# EAGLE design braeburn (EAGLE 6.1)
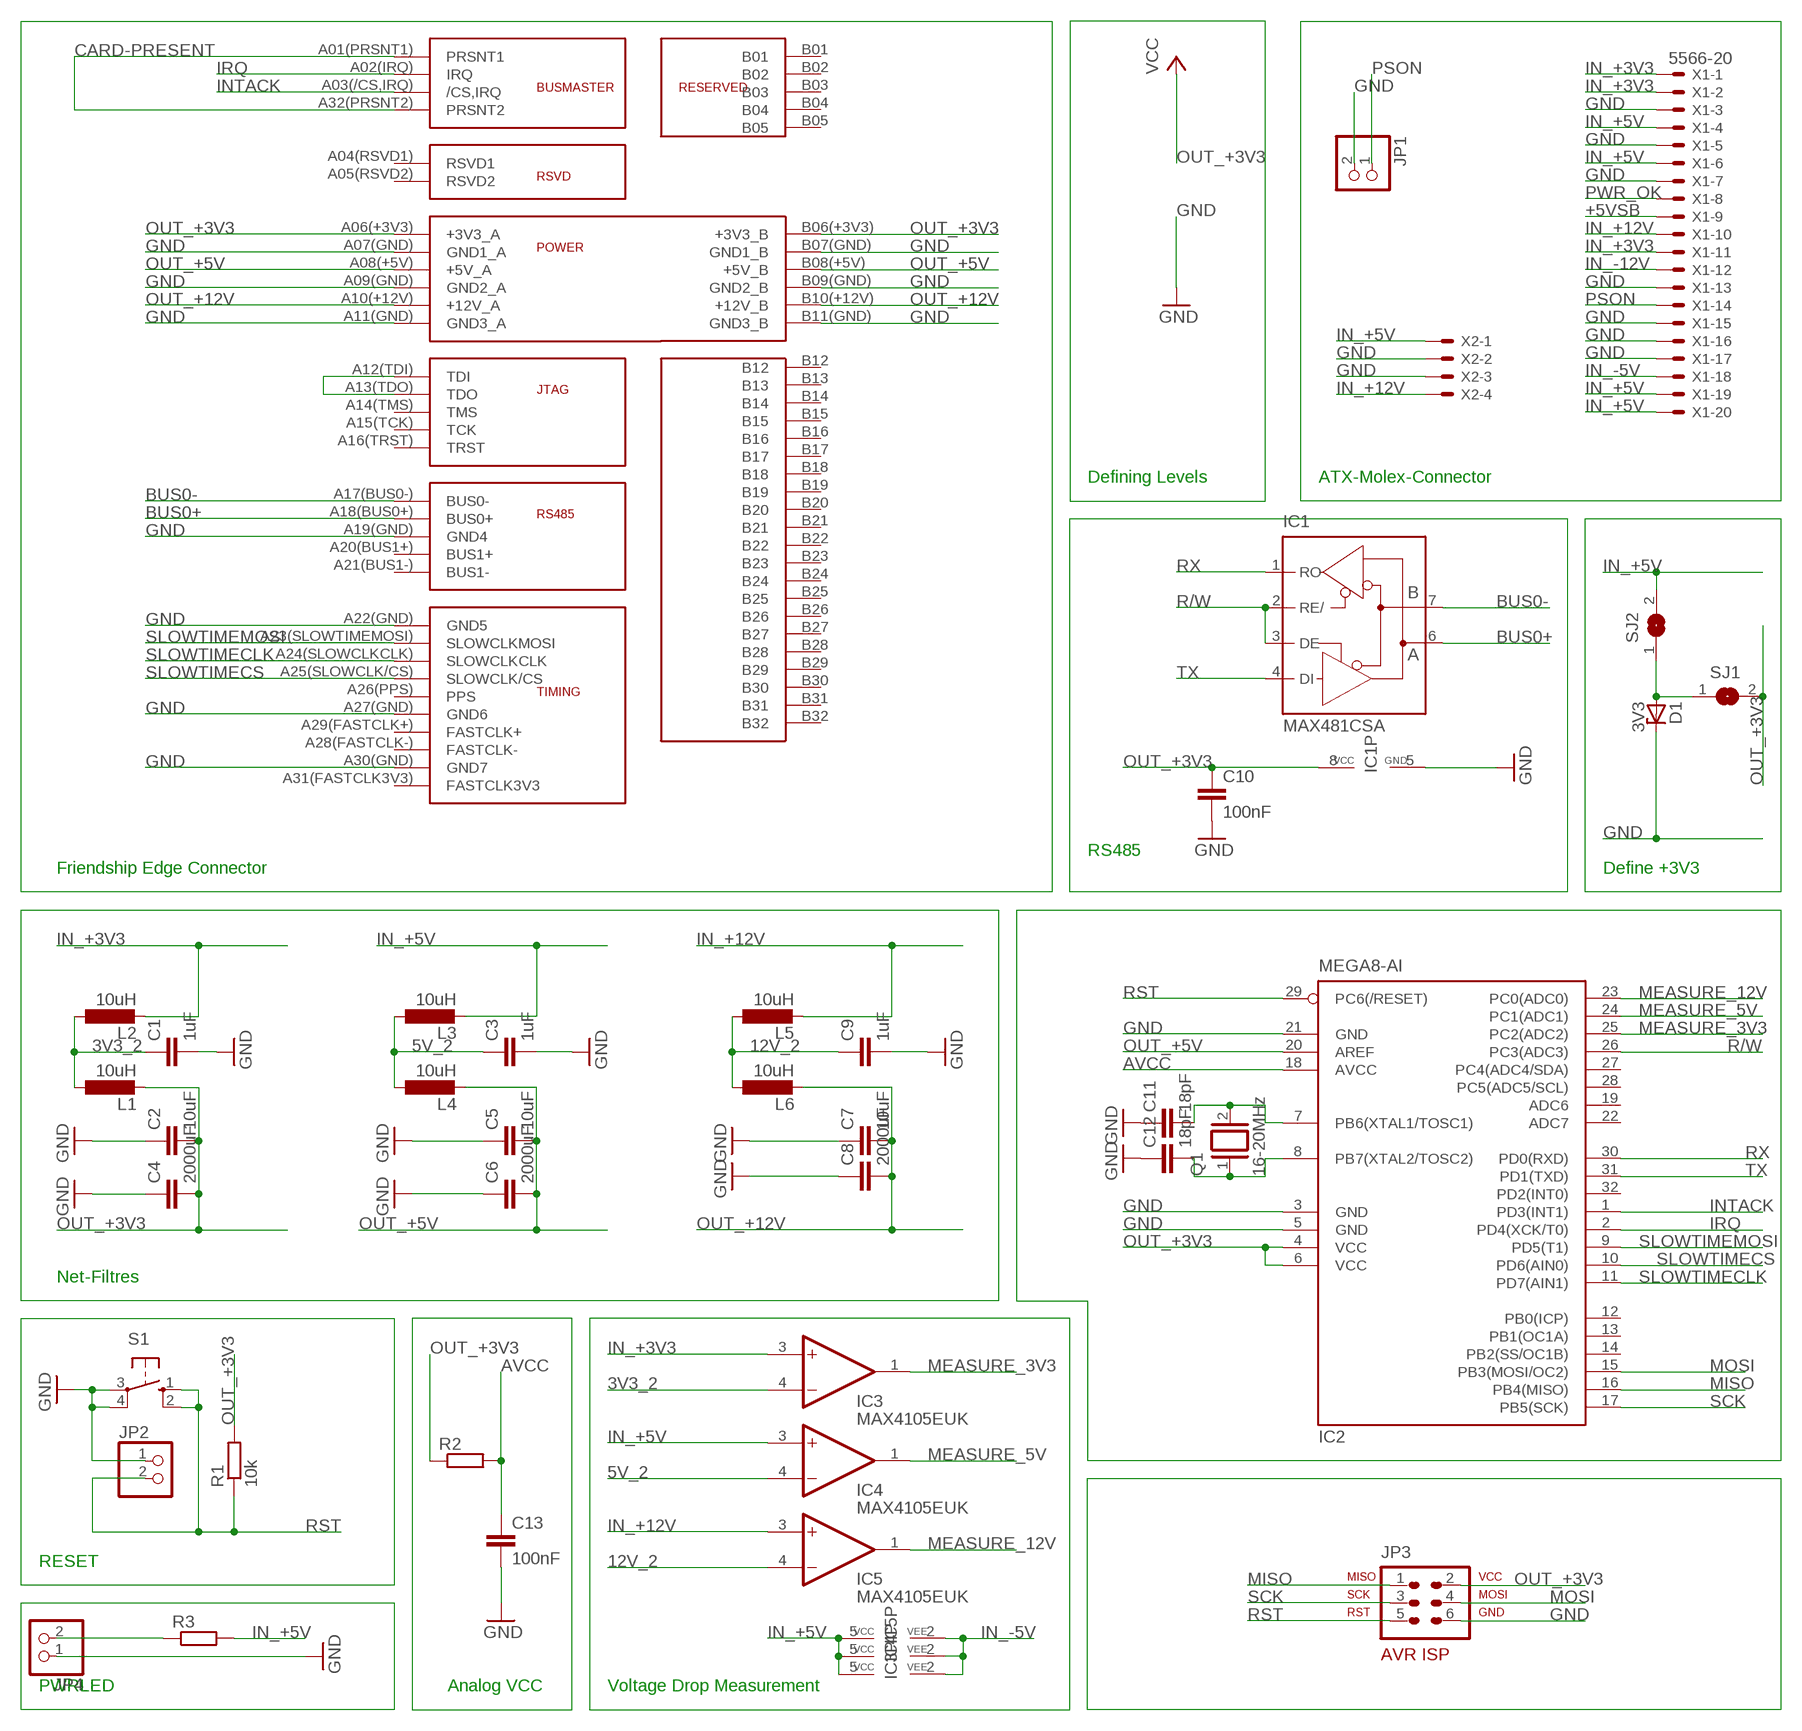
[diagram p0: schematic, sheet 1]

## Parts
C1  1uF  C-EUC0805  [C0805]
C2  10uF  C-EUC0603  [C0603]
C3  1uF  C-EUC0805  [C0805]
C4  2000uF  C-EU025-060X050  [C025-060X050]
C5  10uF  C-EUC0603  [C0603]
C6  2000uF  C-EU025-060X050  [C025-060X050]
C7  10uF  C-EUC0603  [C0603]
C8  2000uF  C-EU025-060X050  [C025-060X050]
C9  1uF  C-EUC0805  [C0805]
C10  100nF  C-EUC0603  [C0603]
C11  18pF  C-EUC0603  [C0603]
C12  18pF  C-EUC0603  [C0603]
C13  100nF  C-EUC0603  [C0603]
D1  3V3  1N4728  [DO41Z10]
IC1  MAX481CSA  [SO08]
IC2  MEGA8-AI  [TQFP32-08]
IC3  MAX4105EUK  [SOT23-5L]
IC4  MAX4105EUK  [SOT23-5L]
IC5  MAX4105EUK  [SOT23-5L]
JP1  PINHD-1X2  [1X02]
JP2  PINHD-1X2  [1X02]
JP3  AVR-ISP-6VERT  [AVR-ISP-6]
JP4  PINHD-1X2  [1X02]
L1  10uH  L-EU0207/5V  [0207/5V]
L2  10uH  L-EU0207/5V  [0207/5V]
L3  10uH  L-EU0207/5V  [0207/5V]
L4  10uH  L-EU0207/5V  [0207/5V]
L5  10uH  L-EU0207/5V  [0207/5V]
L6  10uH  L-EU0207/5V  [0207/5V]
Q1  16-20MHz  XTAL/S  [QS]
R1  10k  R-EU_R0603  [R0603]
R2  R-EU_R0603  [R0603]
R3  R-EU_R0603  [R0603]
S1  10-XX  [B3F-10XX]
SJ1  SJW  [SJW]
SJ2  SJW  [SJW]
U$1  FRIENDSHIPCONNECTOR  [FRIENDSHIP_EDGE_CONNECTOR]
X1  5566-20  [5566-20]
X2  KK-156-4  [KK-156-4]

## Nets
3V3_2: C1.1 IC3.4(-IN) L1.1 L2.1
5V_2: C3.1 IC4.4(-IN) L3.1 L4.1
12V_2: C9.1 IC5.4(-IN) L5.1 L6.1
+5VSB: X1.9
AVCC: C13.1 IC2.18(AVCC) R2.2
BUS0+: IC1.6(A) U$1.A18(BUS0+)(BUS0+)
BUS0-: IC1.7(B) U$1.A17(BUS0-)(BUS0-)
CARD-PRESENT: U$1.A01(PRSNT1)(PRSNT1) U$1.A32(PRSNT2)(PRSNT2)
GND: C1.2 C2.1 C3.2 C4.1 C5.1 C6.1 C7.1 C8.1 C9.2 C10.2 C11.1 C12.1 C13.2 D1.C IC1.5(GND) IC2.3(GND) IC2.5(GND) IC2.21(GND) JP1.2 JP2.1 JP3.6 JP4.1 S1.3(P) S1.4(P1) U$1.A07(GND)(GND1_A) U$1.A09(GND)(GND2_A) U$1.A11(GND)(GND3_A) U$1.A19(GND)(GND4) U$1.A22(GND)(GND5) U$1.A27(GND)(GND6) U$1.A30(GND)(GND7) U$1.B07(GND)(GND1_B) U$1.B09(GND)(GND2_B) U$1.B11(GND)(GND3_B) X1.3 X1.5 X1.7 X1.13 X1.15 X1.16 X1.17 X2.2 X2.3
IN_+3V3: IC3.3(+IN) L2.2 X1.1 X1.2 X1.11
IN_+5V: IC3.5(VCC) IC4.3(+IN) IC4.5(VCC) IC5.5(VCC) L3.2 R3.2 SJ2.2 X1.4 X1.6 X1.19 X1.20 X2.1
IN_+12V: IC5.3(+IN) L5.2 X1.10 X2.4
IN_-5V: IC3.2(VEE) IC4.2(VEE) IC5.2(VEE) X1.18
IN_-12V: X1.12
INTACK: IC2.1(PD3(INT1)) U$1.A03(/CS,IRQ)(/CS,IRQ)
IRQ: IC2.2(PD4(XCK/T0)) U$1.A02(IRQ)(IRQ)
MEASURE_3V3: IC2.25(PC2(ADC2)) IC3.1(OUT)
MEASURE_5V: IC2.24(PC1(ADC1)) IC4.1(OUT)
MEASURE_12V: IC2.23(PC0(ADC0)) IC5.1(OUT)
MISO: IC2.16(PB4(MISO)) JP3.1
MOSI: IC2.15(PB3(MOSI/OC2)) JP3.4
N$4: U$1.A12(TDI)(TDI) U$1.A13(TDO)(TDO)
N$8: JP4.2 R3.1
N$12: C11.2 IC2.7(PB6(XTAL1/TOSC1)) Q1.2
N$13: C12.2 IC2.8(PB7(XTAL2/TOSC2)) Q1.1
N$15: D1.A SJ1.1 SJ2.1
OUT_+3V3: C2.2 C4.2 C10.1 IC1.8(VCC) IC2.4(VCC) IC2.6(VCC) JP3.2 L1.2 R1.2 R2.1 SJ1.2 U$1.A06(+3V3)(+3V3_A) U$1.B06(+3V3)(+3V3_B) ; supply symbol labelled VCC
OUT_+5V: C5.2 C6.2 IC2.20(AREF) L4.2 U$1.A08(+5V)(+5V_A) U$1.B08(+5V)(+5V_B)
OUT_+12V: C7.2 C8.2 L6.2 U$1.A10(+12V)(+12V_A) U$1.B10(+12V)(+12V_B)
PSON: JP1.1 X1.14
PWR_OK: X1.8
R/W: IC1.2(RE/) IC1.3(DE) IC2.26(PC3(ADC3))
RST: IC2.29(PC6(/RESET)) JP2.2 JP3.5 R1.1 S1.1(S) S1.2(S1)
RX: IC1.1(RO) IC2.30(PD0(RXD))
SCK: IC2.17(PB5(SCK)) JP3.3
SLOWTIMECLK: IC2.11(PD7(AIN1)) U$1.A24(SLOWCLKCLK)(SLOWCLKCLK)
SLOWTIMECS: IC2.10(PD6(AIN0)) U$1.A25(SLOWCLK/CS)(SLOWCLK/CS)
SLOWTIMEMOSI: IC2.9(PD5(T1)) U$1.A23(SLOWTIMEMOSI)(SLOWCLKMOSI)
TX: IC1.4(DI) IC2.31(PD1(TXD))
Unconnected: IC2.12(PB0(ICP)) IC2.13(PB1(OC1A)) IC2.14(PB2(SS/OC1B)) IC2.19(ADC6) IC2.22(ADC7) IC2.27(PC4(ADC4/SDA)) IC2.28(PC5(ADC5/SCL)) IC2.32(PD2(INT0)) U$1.A04(RSVD1)(RSVD1) U$1.A05(RSVD2)(RSVD2) U$1.A14(TMS)(TMS) U$1.A15(TCK)(TCK) U$1.A16(TRST)(TRST) U$1.A20(BUS1+)(BUS1+) U$1.A21(BUS1-)(BUS1-) U$1.A26(PPS)(PPS) U$1.A28(FASTCLK-)(FASTCLK-) U$1.A29(FASTCLK+)(FASTCLK+) U$1.A31(FASTCLK3V3)(FASTCLK3V3) U$1.B01 U$1.B02 U$1.B03 U$1.B04 U$1.B05 U$1.B12 U$1.B13 U$1.B14 U$1.B15 U$1.B16 U$1.B17 U$1.B18 U$1.B19 U$1.B20 U$1.B21 U$1.B22 U$1.B23 U$1.B24 U$1.B25 U$1.B26 U$1.B27 U$1.B28 U$1.B29 U$1.B30 U$1.B31 U$1.B32

## Notes on the sheet
- Defining Levels | ATX-Molex-Connector
- RS485
- Friendship Edge Connector | Define +3V3
- Net-Filtres
- RESET
- PWRLED | Analog VCC | Voltage Drop Measurement

## Library data of the parts
C1-C13 = rcl:C-EU: CAPACITOR, European symbol
D1 = diode:1N4728: Z DIODE 3.3 V, 1W, 5 percent
IC1 = maxim:MAX481CSA: RS485 TRANSEIVER; MF: MAXIM; MPN: MAX481CSA; OC_FARNELL: unknown; OC_NEWARK: 90C3817
IC2 = atmel:MEGA8: MICROCONTROLLER 8 Kbytes FLASH, 1 kbytes SRAM, 512 bytes EEPROM, USART, 6-channel 10 bit ADC, 2-channel 8 bit ADC Pin compatible with Atmega48, ATMega88, ATMega168 Source: avr.lbr; MPN: ATMEGA8-16AU; OC_FARNELL: 9171371; OC_NEWARK: 73M8863
IC3-IC5 = maxim:MAX4105EUK: OP AMP; MPN: MAX4105EUK+T; OC_FARNELL: unknown; OC_NEWARK: 67K5152
JP1 JP2 JP4 = pinhead:PINHD-1X2: PIN HEADER
JP3 = avr-7:AVR-ISP-6: AVR ISP-6 Serial Programming Header
L1-L6 = rcl:L-EU: INDUCTOR, European symbol
Q1 = special:XTAL/S: CRYSTAL
R1-R3 = rcl:R-EU_: RESISTOR, European symbol
S1 = switch-omron:10-XX: OMRON SWITCH; MPN: B3F-1000; OC_FARNELL: 176432; OC_NEWARK: 36M3542
SJ1 SJ2 = jumper:SJ: SMD solder JUMPER
U$1 = hgg:FRIENDSHIP
X1 = con-molex:5566-20: Mini FIT connector 20 pol ATX PC-Motherboard Power connector Source: http://www.molex.com; OC_FARNELL: unknown; OC_NEWARK: unknown
X2 = con-molex:KK-156-4: KK 156 HEADER Source: http://www.molex.com/pdm_docs/sd/026604100_sd.pdf; OC_FARNELL: unknown; OC_NEWARK: unknown

## Board
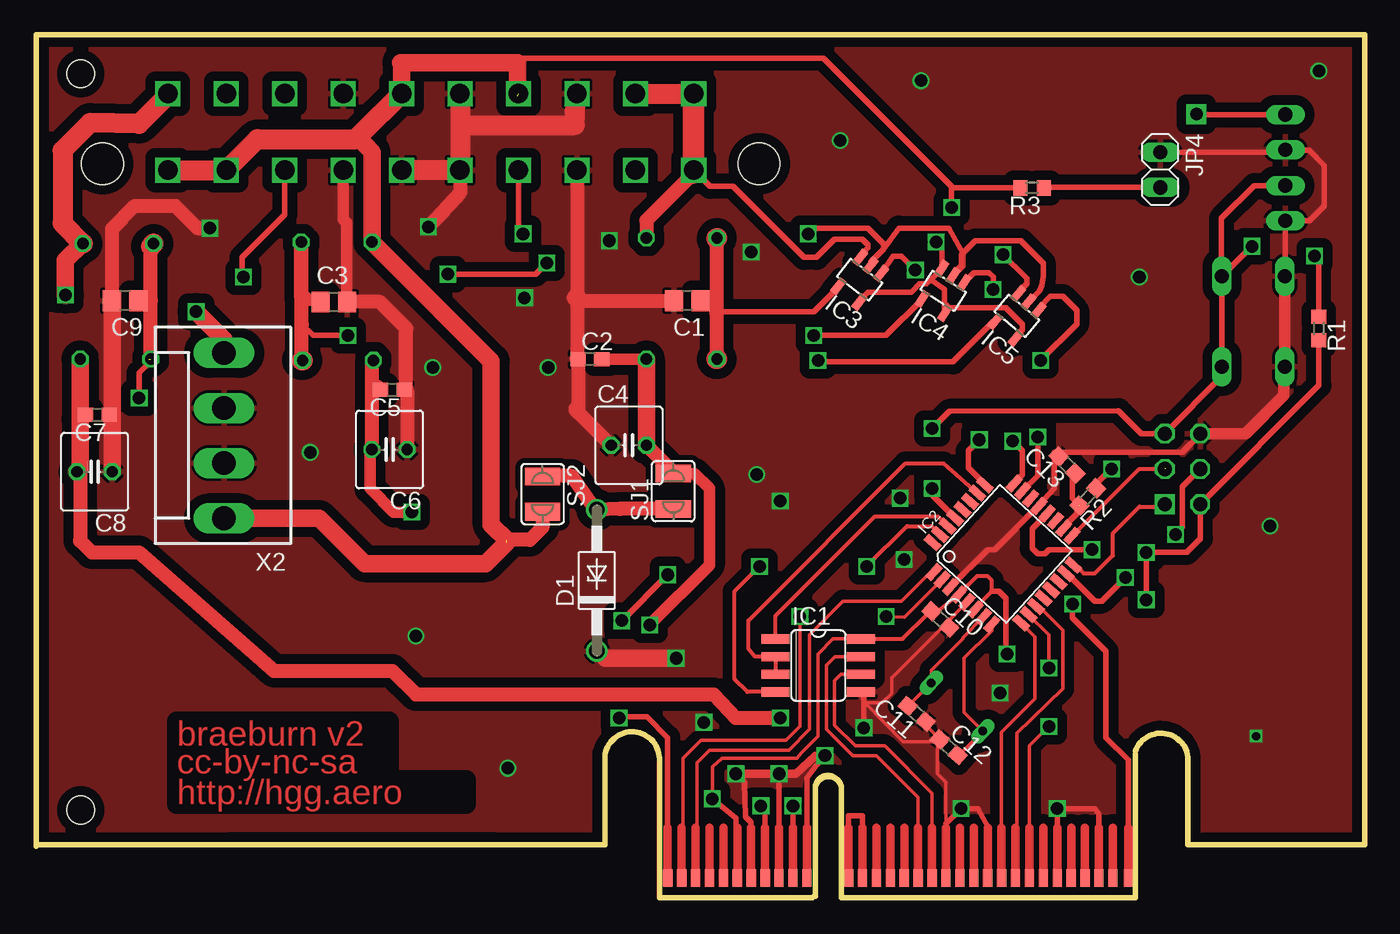
[diagram p1: board, top side]
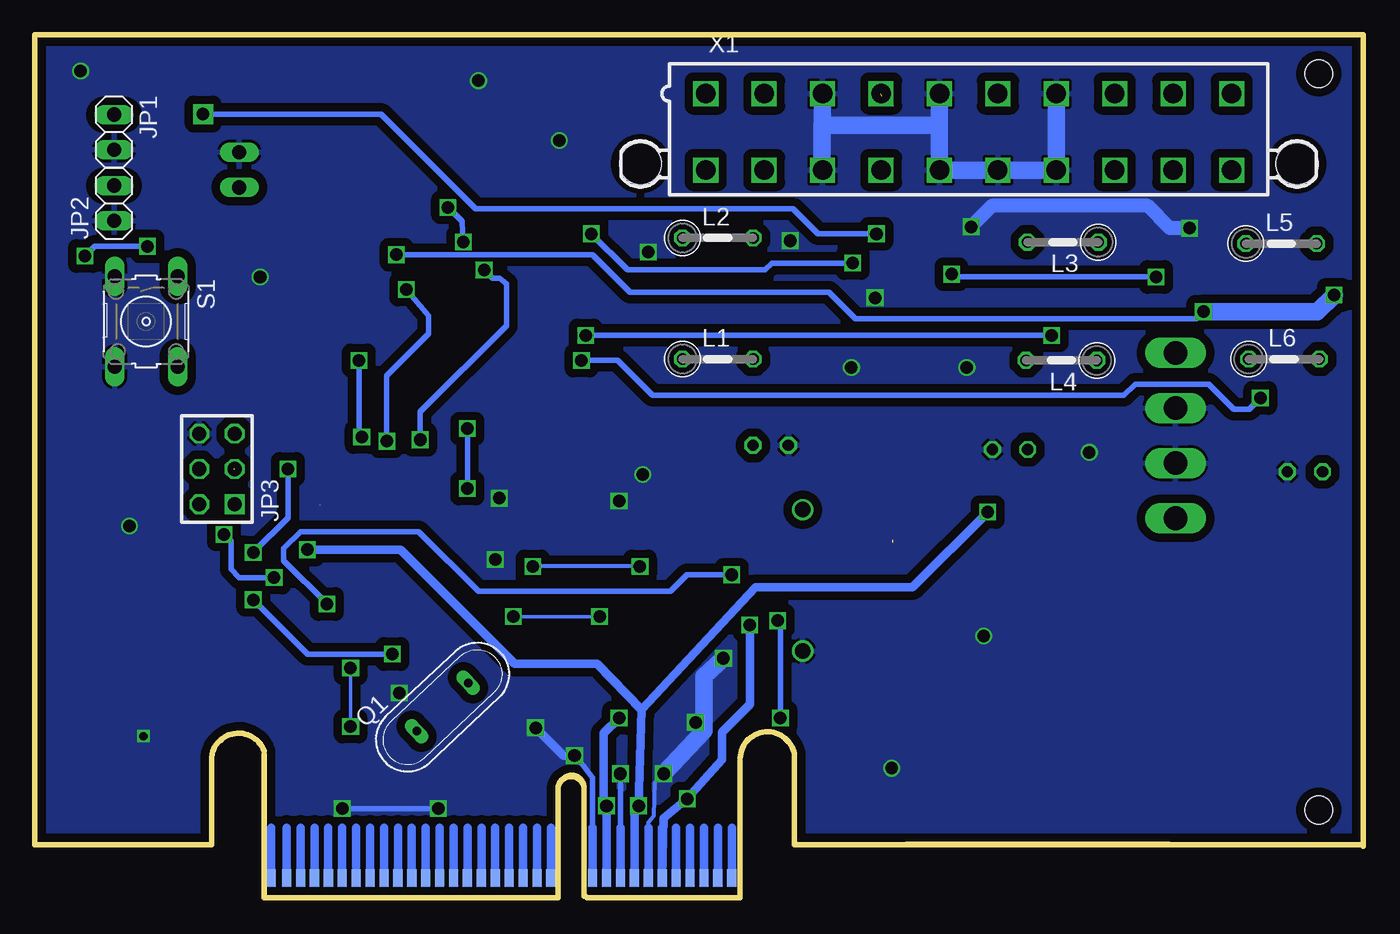
[diagram p2: board, bottom side, seen from below]

Size 95.6 x 62.09 mm. Coordinates in mm from the lower left corner, seen from the top.
Outline: 0.1,3.89 41,3.89 41,10.29
Outline: 41,10.39 arc-168 44.9,10.09
Outline: 44.9,9.89 44.9,0.09 55.9,0.09
Outline: 56,0.19 56.1,0.19 56.1,7.79
Outline: 56.1,7.89 arc-180 58,7.79
Outline: 58,7.69 58,0.09 79.1,0.09 79.1,10.39
Outline: 79.1,10.59 arc-153 82.9,10.19
Outline: 82.9,10.09 82.9,3.89 95.6,3.89 95.6,62.09 0.1,62.09 0.1,3.79
Copper layers (1+2*15+16): Top 0.035mm / dielectric 0.38mm / layer 2 0.035mm / dielectric 0.71mm / layer 15 0.035mm / dielectric 0.38mm / Bottom 0.035mm
Design rules: minimum track width 0.15mm, minimum drill 0.3mm, track to track 0.15mm, track to pad 0.15mm, pad to pad 0.15mm, via to via 0.15mm, smd to smd 0.15mm, copper to edge 0.3mm, drill to drill 0.2mm, minimum pad ring 0.2mm, minimum via ring 0.15mm, stop-mask expansion 0.075mm, vias tented up to drill 0mil, thermal gap 0.2mm
Holes 2 mm at 3.3,59.29 3.3,6.39

### Footprints (pad centres in the part's own frame; a part is rotated, then mirrored left to right if it is on the bottom)
C0805 = smd 1.3 x 1.5: 1 -0.95,0; 2 0.95,0
C0603 = smd 1.1 x 1: 1 -0.85,0; 2 0.85,0
C025-060X050 = drill 0.813 octagon: 1 -1.27,0; 2 1.27,0
DO41Z10 = drill 1.118: A 5.08,0; C -5.08,0
SO08 = smd 0.66 x 2.032: 1 -1.905,-3.073; 2 -0.635,-3.073; 3 0.635,-3.073; 4 1.905,-3.073; 5 1.905,3.073; 6 0.635,3.073; 7 -0.635,3.073; 8 -1.905,3.073
TQFP32-08 = smd 1.27 x 0.559: 1 -4.293,2.8; 2 -4.293,2; 3 -4.293,1.2; 4 -4.293,0.4; 5 -4.293,-0.4; 6 -4.293,-1.2; 7 -4.293,-2; 8 -4.293,-2.8; 17 4.293,-2.8; 18 4.293,-2; 19 4.293,-1.2; 20 4.293,-0.4; 21 4.293,0.4; 22 4.293,1.2; 23 4.293,2; 24 4.293,2.8 | smd 0.559 x 1.27: 9 -2.8,-4.293; 10 -2,-4.293; 11 -1.2,-4.293; 12 -0.4,-4.293; 13 0.4,-4.293; 14 1.2,-4.293; 15 2,-4.293; 16 2.8,-4.293; 25 2.8,4.293; 26 2,4.293; 27 1.2,4.293; 28 0.4,4.293; 29 -0.4,4.293; 30 -1.2,4.293; 31 -2,4.293; 32 -2.8,4.293
SOT23-5L = smd 0.55 x 1.2: 1 -0.95,-1.3; 2 0,-1.3; 3 0.95,-1.3; 4 0.95,1.3; 5 -0.95,1.3
1X02 = drill 1.016 long: 1 -1.27,0; 2 1.27,0
AVR-ISP-6 = drill 1.016 square: 1 -2.54,-1.27 | drill 1.016 octagon: 2 -2.54,1.27; 3 0,-1.27; 4 0,1.27; 5 2.54,-1.27; 6 2.54,1.27
0207/5V = drill 0.813 octagon: 1 -2.54,0; 2 2.54,0
QS = drill 0.61 long: 1 -2.54,0; 2 2.54,0
R0603 = smd 1 x 1.1: 1 -0.85,0; 2 0.85,0
B3F-10XX = drill 1.016 long: 1 -3.251,2.261; 2 3.251,2.261; 3 -3.251,-2.261; 4 3.251,-2.261
SJW = smd 1.27 x 2.54: 1 -1.27,0; 2 1.27,0
FRIENDSHIP_EDGE_CONNECTOR = smd 0.66 x 1.27: A01(PRSNT1) 45.5,-14.5; A02(IRQ) 46.5,-14.5; A03(/CS,IRQ) 47.5,-14.5; A04(RSVD1) 48.5,-14.5; A05(RSVD2) 49.5,-14.5; A06(+3V3) 50.5,-14.5; A07(GND) 51.5,-14.5; A08(+5V) 52.5,-14.5; A09(GND) 53.5,-14.5; A10(+12V) 54.5,-14.5; A11(GND) 55.5,-14.5; A12(TDI) 58.5,-14.5; A13(TDO) 59.5,-14.5; A14(TMS) 60.5,-14.5; A15(TCK) 61.5,-14.5; A16(TRST) 62.5,-14.5; A17(BUS0-) 63.5,-14.5; A18(BUS0+) 64.5,-14.5; A19(GND) 65.5,-14.5; A20(BUS1+) 66.5,-14.5; A21(BUS1-) 67.5,-14.5; A22(GND) 68.5,-14.5; A23(SLOWTIMEMOSI) 69.5,-14.5; A24(SLOWCLKCLK) 70.5,-14.5; A25(SLOWCLK/CS) 71.5,-14.5; A26(PPS) 72.5,-14.5; A27(GND) 73.5,-14.5; A28(FASTCLK-) 74.5,-14.5; A29(FASTCLK+) 75.5,-14.5; A30(GND) 76.5,-14.5; A31(FASTCLK3V3) 77.5,-14.5; A32(PRSNT2) 78.6,-14.5 | smd 0.66 x 1.27 bottom: B01 45.5,-14.5; B02 46.5,-14.5; B03 47.5,-14.5; B04 48.5,-14.5; B05 49.5,-14.5; B06(+3V3) 50.5,-14.5; B07(GND) 51.5,-14.5; B08(+5V) 52.5,-14.5; B09(GND) 53.5,-14.5; B10(+12V) 54.5,-14.5; B11(GND) 55.5,-14.5; B12 58.5,-14.5; B13 59.5,-14.5; B14 60.5,-14.5; B15 61.5,-14.5; B16 62.5,-14.5; B17 63.5,-14.5; B18 64.5,-14.5; B19 65.5,-14.5; B20 66.5,-14.5; B21 67.5,-14.5; B22 68.5,-14.5; B23 69.5,-14.5; B24 70.5,-14.5; B25 71.5,-14.5; B26 72.5,-14.5; B27 73.5,-14.5; B28 74.5,-14.5; B29 75.5,-14.5; B30 76.5,-14.5; B31 77.5,-14.5; B32 78.6,-14.5
5566-20 = drill 1.4 square: 1 18.9,-2.75; 2 14.7,-2.75; 3 10.5,-2.75; 4 6.3,-2.75; 5 2.1,-2.75; 6 -2.1,-2.75; 7 -6.3,-2.75; 8 -10.5,-2.75; 9 -14.7,-2.75; 10 -18.9,-2.75; 11 18.9,2.75; 12 14.7,2.75; 13 10.5,2.75; 14 6.3,2.75; 15 2.1,2.75; 16 -2.1,2.75; 17 -6.3,2.75; 18 -10.5,2.75; 19 -14.7,2.75; 20 -18.9,2.75 | hole 3: 23.6,2.29; -23.6,2.29
KK-156-4 = drill 1.7 pad 2.184 long: 1 -5.94,0; 2 -1.98,0; 3 1.98,0; 4 5.94,0

### Placement (x,y rotation side)
C1  46.9,42.99 180 top
C2  39.9,38.79 0 top
C3  21.5,42.89 0 top
C4  42.7,32.59 0 top
C5  25.7,36.59 180 top
C6  25.5,32.29 180 top
C7  4.5,34.79 180 top
C8  4.3,30.69 180 top
C9  6.5,42.99 180 top
C10  65.1,20.09 316.9 top
C11  63.4,13.29 139 top
C12  65.7,10.89 318.3 top
C13  74.2,31.19 135 top
D1  40.4,22.89 90 top
IC1  56.32,16.77 270 top
IC2  69.6,24.79 47.8 top
IC3  59.3,44.49 142.6 top
IC4  65.3,43.69 147.2 top
IC5  70.6,41.89 140.4 top
JP1  89.9,55.09 270 bottom
JP2  89.9,49.99 90 bottom
JP3  82.5,30.89 90 bottom
JP4  80.9,52.39 270 top
L1  46.5,38.79 0 bottom
L2  46.5,47.49 0 bottom
L3  21.7,47.19 180 bottom
L4  21.8,38.69 180 bottom
L5  6,47.09 0 bottom
L6  5.8,38.79 0 bottom
Q1  66.3,13.79 43.2 bottom
R1  92.3,40.99 270 top
R2  75.7,28.89 226.3 top
R3  71.7,51.09 180 top
S1  87.6,41.49 270 bottom
SJ1  45.9,29.29 90 top
SJ2  36.5,29.09 270 top
U$1  0,16 0 top
X1  28.47,55.11 180 bottom
X2  13.6,33.29 90 top

### Tracks (layer width: path | path; a pad name or v marks a point on that pad's centre or on a via)
3V3_2
  Top 0.406: IC3.4 57.76,43.95 56,42.19 49.1,42.19 49,42.09
  Top 0.61: C1.1 48.05,43.19 49,43.19
  Top 1.016: 49,47.45 49,43.19 49,42.09 49,38.79
  Top 1.422: L2.1 49,47.45 | L1.1 49,38.79
5V_2  (via drill 0.9)
  Top 0.406: L4.1 19.05,38.48 | IC4.4 63.8,43.09 61.2,40.49 v56,40.49 | v22.5,40.49 20,40.49 19.2,41.29
  Top 0.61: 19.2,43.29 19.6,43.29 19.6,42.89 C3.1 19.4,42.89 19.4,43.19 19.16,43.19
  Top 1.016: 19.2,38.69 19.2,41.29 19.2,43.29 19.2,47.29 | 19.16,43.19 L3.1
  Top 1.422: L4.1 19.2,38.69
  Bottom 0.406: v56,40.49 v22.5,40.49
12V_2  (via drill 0.9)  (1 unrouted)
  Top 0.406: IC5.4 68.9,41.49 66,38.59 56.4,38.59 v56.3,38.69 | v7.5,35.99 7.5,37.79 8.5,38.79 8.2,38.79
  Top 0.61: C9.1 8.34,42.99
  Top 1.016: L6.1 8.34,42.99 8.34,46.89
  Top 1.422: 8.34,46.89 L5.1
  Bottom 0.406: v56.3,38.69 53.7,38.69 51.2,36.19 17.3,36.19 16.5,36.99 11.2,36.99 9.4,35.19 8.3,35.19 v7.5,35.99
AVCC  (1 unrouted)
  Top 0.406: IC2.18 73.97,26.75 74.9,27.69 74.9,27.99 75.2,28.29 | 75.2,28.29 75.2,28.39 | 74.7,28.69 R2.2 74.6,28.79 74.6,30.39 C13.1 | 75.2,28.29 R2.2
BUS0+
  Top 0.254: U$1.A18(BUS0+) 64.5,7.59 61.1,10.99 59,10.99 57.5,12.49 57.5,15.69 57.95,16.13 IC1.6
BUS0-
  Top 0.254: U$1.A17(BUS0-) 63.5,7.29 60.5,10.29 58.8,10.29 56.9,12.19 56.9,16.79 57.52,17.4 IC1.7
CARD-PRESENT  (via drill 0.9)
  Top 0.406: U$1.A01(PRSNT1) 45.5,11.59 44,13.09 42.1,13.09 v42,12.99 | v42.2,19.99 v45.5,23.29 | v74.6,21.19 74.6,20.19 77,17.79 77,11.59 78.6,9.99 U$1.A32(PRSNT2)
  Bottom 0.406: v42,12.99 42,19.79 v42.2,19.99 | v45.5,23.29 48.7,23.29 49.9,22.09 63.7,22.09 68,26.39 76.5,26.39 77.7,25.19 77.7,24.29 v74.6,21.19
GND  (via drill 0.6, 0.9)
  Top 0.254: C11.1 64.04,12.48 C12.1 64.9,11.29 | 64.9,11.29 62.4,11.29 59.73,14.06 IC1.5 59.57,14.09 60.9,14.09 61.6,14.79 61.6,15.89 65.35,19.64 67.01,21.3 IC2.5 | 64.9,11.29 64.9,8.99 65.5,8.39 U$1.A19(GND)
  Top 0.406: S1.3 89.9,44.78 JP2.1 91.63,48.72 92.7,49.79 92.7,52.69 91.6,53.79 89.93,53.79 JP1.2 89.74,53.66 JP4.1 | IC2.3 68.5,25.09 69,25.09 72.15,28.24 IC2.21 72.19,28.28 73.3,29.49 73.3,32.09 73.7,32.09 | C10.2 65.48,19.51 65.35,19.64 | 73.7,32.09 82.5,32.09 83.8,33.39 83.8,33.4 JP3.6 | C13.2 73.6,31.99 73.7,32.09 | C7.1 5.55,34.99 | U$1.B07(GND) 51.5,5.49 51.1,5.89 51,8.39 v50.4,8.99 | U$1.B11(GND) 55.5,8.69 56.2,9.59 v56.8,10.29 | U$1.B09(GND) v53.5,8.99 | v59.6,12.29 59.6,14.89 | U$1.A19(GND) 65.5,5.39 v66.6,6.49 67.8,6.49 68.5,5.19 U$1.A22(GND) | U$1.A27(GND) v73.5,6.49 76.2,6.49 76.5,6.09 U$1.A30(GND)
  Top 0.61: v50.4,8.99 v53.5,8.99 54.7,8.99 56.1,10.29 v56.8,10.29
  Top 0.813: JP3.6 87.04,33.43 89.8,36.19 89.8,38.18 S1.4 S1.3 | C3.2 22.4,42.94 22.4,48.59 22.17,48.82 X1.17 | 38.97,38.87 C2.1 39.05,42.74 39.3,42.99 | C4.1 41.43,32.66 38.8,35.29 38.8,35.09 39.1,34.79
  Top 1.016: C6.1 26.77,36.37 C5.1 26.7,36.74 26.7,40.99 24.8,42.89 C3.2 | X1.13 38.97,43.29 38.97,38.87 | 39.3,42.99 C1.2 | C9.2 5.55,48.14 7.2,49.79 10.1,49.79 11.7,48.19 v12.6,48.19 | C2.1 39.05,34.97 C4.1 | 41.02,17.29 D1.C | v28.3,48.29 29.7,49.79 30.6,50.79 X1.15
  Top 1.27: C9.2 5.55,34.99 5.55,30.71 C8.1 | 38.87,43.19 38.97,43.29 | v46.1,17.29 41.02,17.29
  Top 1.422: X1.16 26.4,52.39 30.6,52.39 | 30.6,55.59 30.6,57.89 | 30.6,52.39 30.6,52.19 | 30.6,52.39 30.6,55.59 | 30.6,55.59 38.8,55.59 38.9,57.99
  Bottom 0.305: U$1.B07(GND) 51.5,5.49 51.1,5.99 51,8.39 v50.4,8.99
  Bottom 0.406: U$1.B09(GND) v53.5,8.99 | v56.8,10.29 56.2,9.59 55.5,8.69 U$1.B11(GND) | v66.6,6.49 v73.5,6.49
  Bottom 0.61: v56.8,10.29 57.6,10.29 v59.6,12.29
  Bottom 1.016: v12.6,48.19 14,48.19 15.6,49.79 26.8,49.79 v28.3,48.29
  Bottom 1.27: X1.7 X1.17 | X1.17 22.17,52.22 22.2,52.19 | X1.17 X1.16 X1.15 30.57,55.39 | 30.57,55.39 X1.5 | X1.3 38.97,55.62 39,55.59 | 39,55.59 30.77,55.59 30.57,55.39 | 39,55.59 39,52.39 X1.13 | v50.4,8.99 47.5,12.09 47.5,15.99 v46.1,17.29
  other vias: 35.2,43.19 63.7,58.79 27.4,18.89 34,9.39 51.9,30.49 88.8,26.79 79.4,44.69 57.9,54.49 36.9,38.19 28.6,38.19 19.8,32.09 92.3,59.49 69.4,14.79 53.6,28.59 62.5,24.39 62.2,28.79 48.1,12.69 41.3,47.29 51.5,46.49 87.8,11.69
  pour Top (isolate 0.7): 0.5,61.79 95.2,61.59 95.2,4.29 83.3,4.29 83.3,10.19 arc90 81.2,12.29 80.9,12.29 arc90 78.5,9.89 78.5,0.49 58.4,0.49 58.4,7.89 arc90 57,9.29 56.7,9.29 arc90 55.8,8.39 55.8,0.49 45.3,0.49 45.3,10.19 arc90 43.1,12.39 42.7,12.39 arc90 40.7,10.39 40.7,4.29 0.4,4.29 0.4,61.59 0.5,61.59
  pour Bottom (isolate 0.61): 0.5,61.79 0.4,4.29 40.7,4.29 40.7,10.59 arc-90 42.5,12.39 43.1,12.39 arc-90 45.2,10.29 45.2,0.49 55.8,0.49 55.8,7.89 arc-90 57,9.09 57.1,9.09 arc-90 58.3,7.89 58.3,0.49 78.8,0.49 78.8,10.49 arc-90 80.6,12.29 81.2,12.29 arc-90 83.3,10.19 83.3,4.29 95.2,4.29 95.2,61.69 0.7,61.79
IN_+3V3
  Top 0.406: IC3.3 59.34,46.22 59.9,46.79 59.9,46.99 59.5,47.39 57.5,47.39 56.2,46.09 55.3,46.09 50.2,51.19 48.54,51.19 X1.11
  Top 1.016: 47.3,52.09 43.96,48.75 L2.2
  Top 1.422: X1.2 47.3,57.86 | 47.3,57.86 47.3,57.89 | 47.3,52.69 47.4,52.69 47.4,52.36 X1.11 X1.1 47.3,57.86 | 47.3,52.69 47.3,57.86 | 47.3,52.69 47.3,52.09
IN_+5V  (via drill 0.9)  (2 unrouted)
  Top 0.406: R3.2 66,51.09 65.9,51.19 | 65.9,51.19 56.7,60.39 34.7,60.39 34.4,60.09 | v64.8,47.19 65.21,46.68 IC4.3 64.4,44.49 | v65.9,49.69 65.9,51.19 | IC3.5 59.27,42.95 59.9,43.59 63,43.59 63.6,44.19 64.1,44.19 64.4,44.49 | IC4.5 65.39,42.79 | 65.39,42.79 65.39,43.8 64.4,44.49 | IC5.5 70.5,40.39 71,40.89 71,41.29 69.8,42.49 65.69,42.49 65.39,42.79
  Top 1.016: SJ2.2 36.5,26.69 35.6,25.79 33.9,25.79
  Top 1.27: 23.4,54.89 23.4,54.59 24.24,53.65 L3.2 32.8,38.63 32.8,26.89 33.9,25.79 | X1.6 26.37,60.02 26.3,60.09 34.4,60.09 34.7,60.09 34.7,57.69 | X2.1 20.44,27.35 23.7,24.09 32.4,24.09 33.9,25.59
  Top 1.422: X1.20 X1.19 16,54.59 23.1,54.59 23.4,54.89 X1.6
  Bottom 0.406: v64.8,47.19 64.9,48.69 v65.9,49.69
IN_+12V  (via drill 0.9)
  Top 0.406: IC5.3 70.7,43.59 71.3,44.19 71.3,44.59 v69.6,46.29
  Top 1.27: X2.4 13.6,40.19 v11.6,42.19 | v2.2,43.39 2.2,45.89 3.4,47.09 L5.2
  Top 1.422: X1.10 9.57,57.76 7.5,55.69 3.97,55.76 2,53.79 2,48.55 L5.2
  Bottom 0.406: v69.6,46.29 55.5,46.29 52.8,43.59 38.5,43.59 36.6,41.69 12.1,41.69 v11.6,42.19
  Bottom 1.27: v11.6,42.19 3.4,42.19 v2.2,43.39
IN_-5V  (via drill 0.9)
  Top 0.406: X1.18 17.97,49.16 14.9,46.09 14.9,44.79 v15,44.69 | v29.7,44.89 36,44.89 v36.8,45.69 | IC3.2 60.09,45.78 61,46.69 | 61,46.69 61,47.09 59.9,48.19 56,48.19 v55.6,47.79 | 61,46.69 62.1,48.19 65.7,48.19 66.7,46.39 66.7,45.48 IC4.2 66,44.89 66.6,45.49 66.6,46.29 67.6,47.29 70.9,47.29 72.5,45.69 72.5,44.79 72.4,44.09 72.2,43.66 IC5.2
  Bottom 0.406: v15,44.69 29.5,44.69 v29.7,44.89 | v36.8,45.69 42.6,45.69 43.1,45.19 53,45.19 v55.6,47.79
INTACK
  Top 0.254: U$1.A03(/CS,IRQ) 47.6,1.6 47.6,9.79 48.5,10.69 54.2,10.69 55.7,12.19 55.7,18.99 58.1,21.39 62.3,21.39 64.4,23.49 IC2.1
IRQ  (via drill 0.9)
  Top 0.254: U$1.A02(IRQ) 46.6,1.6 46.6,10.09 47.9,11.39 54,11.39 55,12.39 v55,20.29 | v61.2,20.29 62.5,20.22 IC2.2
  Bottom 0.254: v55,20.29 v61.2,20.29
MEASURE_3V3  (via drill 0.9)
  Top 0.406: IC2.25 68.3,29.79 67.1,30.99 67.1,32.19 v67.9,32.99 | v63.3,45.19 62.3,46.19 61.69,46.19 IC3.1
  Bottom 0.406: v67.9,32.99 67.9,34.99 61.7,41.19 61.7,44.19 62.2,44.59 62.7,44.59 v63.3,45.19
MEASURE_5V  (via drill 0.9)
  Top 0.406: IC2.24 70.41,29.9 71,30.49 71,32.19 v70.3,32.89 | v68.9,43.79 68.9,44.69 68.6,44.99 67.53,44.99 IC4.1
  Bottom 0.406: v70.3,32.89 70.3,37.59 67.3,40.59 67.3,41.89 v68.9,43.79
MEASURE_12V  (via drill 0.9)
  Top 0.406: IC5.1 72.16,42.45 73,43.29 73.9,43.29 74.9,42.29 74.9,41.29 v72.3,38.69 | v72.1,33.19 72.1,30.41 IC2.23
  Bottom 0.406: v72.3,38.69 72.3,33.39 v72.1,33.19
MISO
  Top 0.305: IC2.16 74.81,23.98 75.4,23.39 76.2,23.39 77.5,24.69 77.5,26.29 79.4,28.19 81.07,28.19 JP3.1
MOSI  (via drill 0.9)
  Top 0.406: IC2.15 74.2,23.39 76.2,21.39 76.7,21.39 v78.4,23.09 | v82,26.19 82,26.29 82.3,26.59 82.4,26.59 82.5,26.69 82.5,29.62 JP3.4
  Bottom 0.406: v78.4,23.09 80.9,23.09 81.5,23.69 81.5,25.69 v82,26.19
N$4
  Top 0.406: U$1.A12(TDI) 58.5,5.99 59.5,5.99 U$1.A13(TDO)
N$8
  Top 0.406: JP4.2 72.53,51.12 72.5,51.09 R3.1
N$12
  Top 0.254: IC2.7 66.7,18.77 66.7,18.69 64.45,16.44 Q1.2 C11.2
N$13
  Top 0.254: IC2.8 68.79,19.28 66.8,17.29 66.8,13.4 Q1.1 66.42,10.32 C12.2
N$15
  Top 1.016: SJ1.1 42.05,28.02 D1.A 40.5,27.69 38.6,30.39 36.53,30.39 SJ2.1
OUT_+3V3  (via drill 0.9)
  Top 0.254: IC1.8 57.38,18.67 56.3,17.59 56.3,11.69 55.1,10.49 54.8,10.09 49.4,10.09 48.7,9.49 v48.7,7.19
  Top 0.305: IC1.8 62.38,18.67 64.2,20.49 64.6,20.46 IC2.4 67.73,23.19 68.5,23.19 68.8,22.89 68.8,22.09 67.61,20.9 IC2.6
  Top 0.406: R1.2 92.3,36.89 JP3.2 83.8,28.32 83.8,25.89 82.8,24.89 v79.9,24.89 v79.9,21.49 | 64.6,20.46 64.67,20.56 64.6,20.59 64.5,20.49 64.4,20.59 64.4,20.69 64.46,20.69 C10.1 | R2.1 76.29,29.78 v77.4,30.89 | 68.8,22.09 69.3,22.09 69.8,21.59 69.8,17.69 v69.9,17.59 | U$1.B06(+3V3) 50.4,5.79 v48.7,7.19
  Top 0.813: C2.2 L1.2 | SJ1.2 47.43,30.56 48.5,29.49 48.5,23.99 v44.2,19.69
  Top 1.016: SJ1.2 45.9,30.66 C4.2
  Top 1.27: L1.2 C4.2
  Bottom 0.406: v77.4,30.89 77.4,27.39 v79.9,24.89 | v69.9,17.59 76,17.59 v79.9,21.49
  Bottom 0.61: U$1.B06(+3V3) 50.4,5.79 v48.7,7.19 46.2,9.99 46.2,11.99 44.2,13.99 v44.2,19.69
OUT_+5V  (via drill 0.9)
  Top 0.406: IC2.20 72.78,27.67 71.7,26.59 71.7,25.19 72.1,24.79 72.6,24.79 72.9,25.09 v76,25.09 | v52.2,6.69 52.5,6.29 U$1.A08(+5V)
  Top 0.61: 24.1,32.16 C6.2
  Top 0.813: v27.1,27.79 25.8,27.79 24.1,29.49 24.1,32.16
  Top 1.016: L4.2 24.23,38.58 24.23,36.79 | 24.23,36.79 C6.2 | C5.2 24.65,36.79 24.23,36.79
  Bottom 0.61: v76,25.09 69.3,25.09 61.1,16.89 55.2,16.89 52,13.59 | 52,13.59 v52.2,6.69 52.5,6.39 U$1.A08(+5V) | 52,13.59 43.8,22.39 32.5,22.39 v27.1,27.79
OUT_+12V  (via drill 0.9)
  Top 0.406: C7.2 3.56,34.79 3.26,34.49 | U$1.A10(+12V) v54.5,6.69
  Top 1.016: 3.26,30.92 3.26,25.73 4.1,24.89 7.5,24.89 17.2,16.39 25.7,16.39 27.4,14.69 48.8,14.69 50.4,12.99 v53.6,12.99
  Top 1.27: L6.2 3.26,34.49 3.26,30.92 C8.2
  Bottom 0.61: v53.6,12.99 54.7,11.89 54.7,6.99 v54.5,6.69 U$1.A10(+12V)
PSON  (via drill 0.9, 0.9 pad 1.42)
  Top 0.406: X1.14 34.77,48.12 v35.1,47.79 | v83.5,56.39 83.53,56.36 JP1.1
  Bottom 0.406: v35.1,47.79 39.3,47.79 41.1,49.59 63.9,49.59 70.7,56.39 v83.5,56.39
R/W
  Top 0.305: IC1.3 IC1.2 51.78,17.4 51.3,17.99 51.3,19.99 62.6,31.29 65.33,31.29 IC2.26
RST  (via drill 0.9)
  Top 0.406: JP2.2 87.67,51.26 85.3,48.89 85.3,44.78 S1.1 | S1.1 S1.2 85.34,37.54 JP3.5 79.56,33.43 77.9,35.09 65.74,35.03 v64.5,33.79 | v64.5,29.49 64.5,29.03 IC2.29 | R1.1 92.3,45.89 v92,46.19 | v87.5,46.89 87.49,46.89 S1.1
  Bottom 0.406: v64.5,33.79 v64.5,29.49 | v92,46.19 91.3,46.89 v87.5,46.89
RX
  Top 0.305: IC1.1 53.25,20.34 60.4,27.49 64.91,27.49 IC2.30
SCK  (1 unrouted)
  Top 0.305: IC2.17 74.6,26.09 79.4,30.89 81.3,30.89
SLOWTIMECLK
  Top 0.254: U$1.A24(SLOWCLKCLK) 70.6,1.6 70.6,11.89 73.9,15.09 73.9,19.29 72.17,21.02 IC2.11
SLOWTIMECS  (via drill 0.9)
  Top 0.254: IC2.10 72.9,18.96 v72.9,16.59 | v72.9,12.39 71.5,10.99 U$1.A25(SLOWCLK/CS)
  Bottom 0.254: v72.9,16.59 v72.9,12.39
SLOWTIMEMOSI
  Top 0.254: IC2.9 71.9,18.83 71.9,14.39 69.5,11.99 U$1.A23(SLOWTIMEMOSI)
TX  (via drill 0.9)
  Top 0.305: IC1.4 51.23,14.86 50.3,15.79 50.3,22.09 v52.1,23.89 | v59.8,23.89 62.7,26.79 64.48,26.79 IC2.31
  Bottom 0.305: v52.1,23.89 v59.8,23.89

### Text on the board
Top: braeburn v2 | cc-by-nc-sa | http://hgg.aero